# Altium schematic sheet Current_Sensing.SchDoc
size A4; SheetNumber: 2; SheetTotal: 6
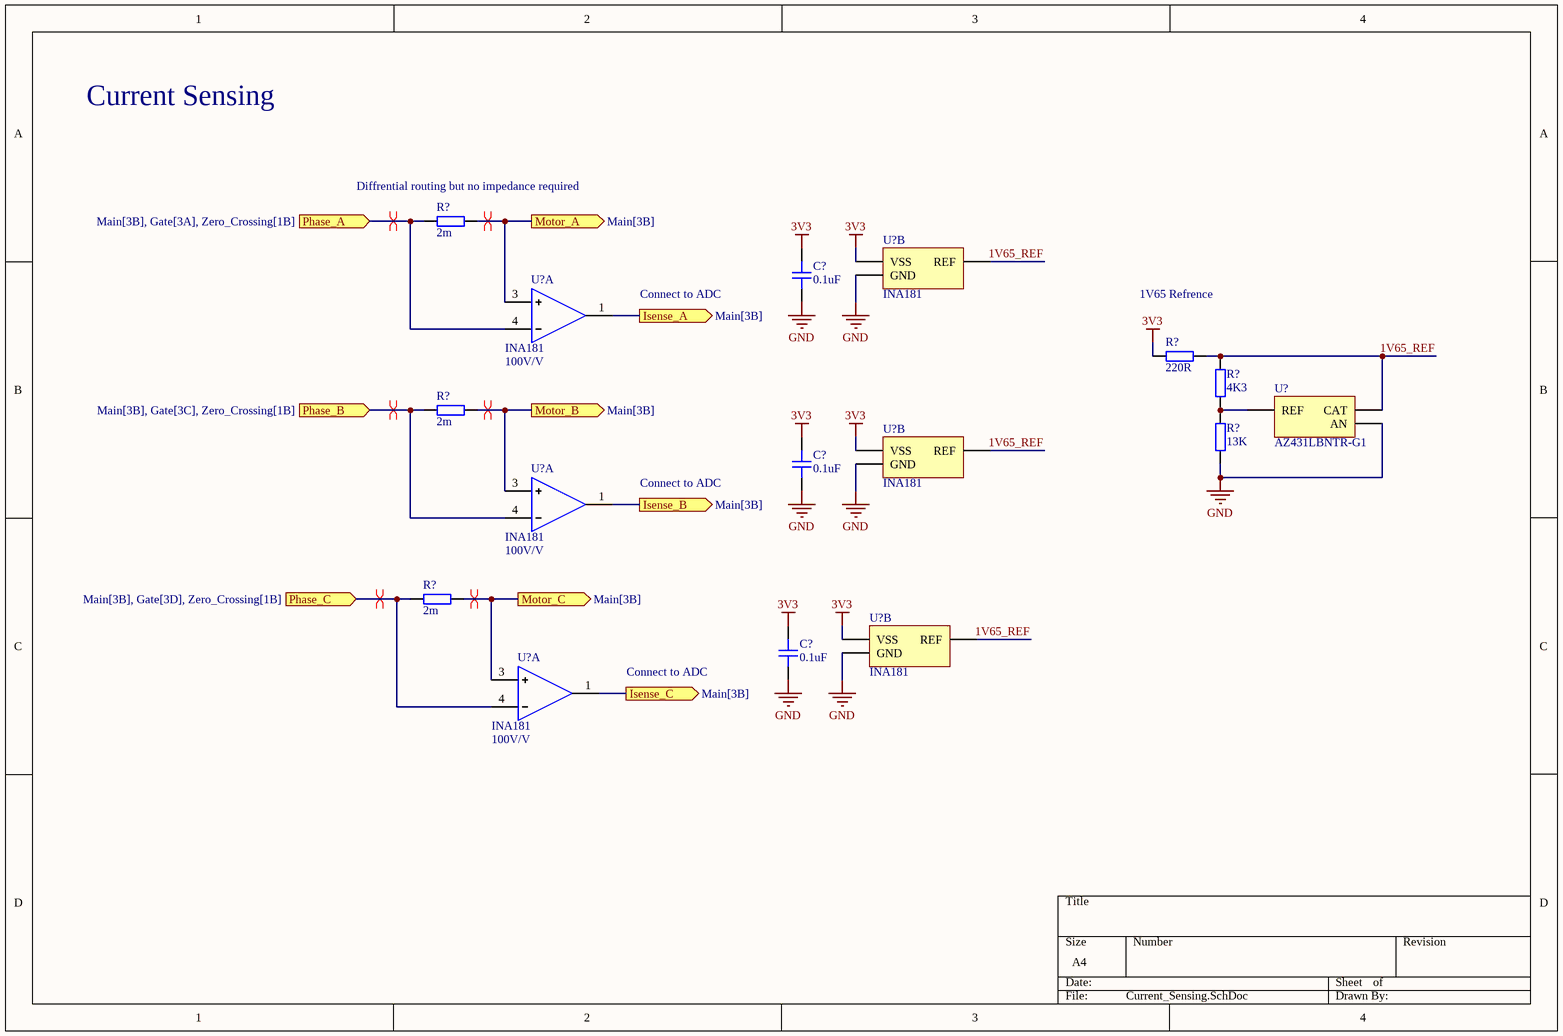
[diagram p0: Current_Sensing.SchDoc]

## Parts
(Parts that share a designator on the sheet are numbered #1, #2 ... from top to bottom, then left to right.)
C?#1  0.1uF  [CAP_0402]
C?#2  0.1uF  [CAP_0402]
C?#3  0.1uF  [CAP_0402]
R?#1  2m  [RES_0402]
R?#2  220R  [RES_0402]
R?#3  4K3  [RES_0402]
R?#4  2m  [RES_0402]
R?#5  13K  [RES_0402]
R?#6  2m  [RES_0402]
U?#1  INA181  [INA181]  (part B of 2)
U?#2  INA181  [INA181]  (part A of 2)
U?#3  AZ431LBNTR-G1  [SOT-23-3]
U?#4  INA181  [INA181]  (part B of 2)
U?#5  INA181  [INA181]  (part A of 2)
U?#6  INA181  [INA181]  (part B of 2)
U?#7  INA181  [INA181]  (part A of 2)

## Ports
Isense_A (out, see Main[3B]), Isense_B (out, see Main[3B]), Isense_C (out, see Main[3B]), Motor_A (out, see Main[3B]), Motor_B (out, see Main[3B]), Motor_C (out, see Main[3B]), Phase_A (in, see Main[3B], Gate[3A], Zero_Crossing[1B]), Phase_B (in, see Main[3B], Gate[3C], Zero_Crossing[1B]), Phase_C (in, see Main[3B], Gate[3D], Zero_Crossing[1B])

## Nets
3V3: C?#1.2 C?#2.2 C?#3.2 R?#2.2 U?#1.6(VSS) U?#4.6(VSS) U?#6.6(VSS)
GND: C?#1.1 C?#2.1 C?#3.1 R?#5.1 U?#1.2(GND) U?#3.3(AN) U?#4.2(GND) U?#6.2(GND)
1V65_REF: R?#2.1 R?#3.2 U?#1.5(REF) U?#3.2(CAT) U?#4.5(REF) U?#6.5(REF)
Isense_A: U?#2.1 ; port Isense_A
Isense_B: U?#5.1 ; port Isense_B
Isense_C: U?#7.1 ; port Isense_C
Motor_A: R?#1.2 U?#2.3 ; port Motor_A
Motor_B: R?#4.2 U?#5.3 ; port Motor_B
Motor_C: R?#6.2 U?#7.3 ; port Motor_C
Phase_A: R?#1.1 U?#2.4 ; port Phase_A
Phase_B: R?#4.1 U?#5.4 ; port Phase_B
Phase_C: R?#6.1 U?#7.4 ; port Phase_C
NetR?#3_1: R?#3.1 R?#5.2 U?#3.1(REF)

## Layout directives
differential pair: Motor_A, Motor_B, Motor_C, Phase_A, Phase_B, Phase_C

## Notes on the sheet
- Current Sensing
- (near R?#1) Diffrential routing but no impedance required
- Connect to ADC
- 1V65 Refrence
- (near U?#2) 100V/V
- (near U?#5) 100V/V
- (near U?#7) 100V/V

## Library data of the parts
C?#1-C?#3 = CAP_0402: Capacitor SMD 0402; Manufacturer: *; Manufacturer Part Number: *; Distributor Link: *; LCSC: *; Rating: *; Dielectric: *
R?#1-R?#6 = RES_0402: Resistor SMD 0402; Manufacturer: *; Manufacturer Part Number: *; Distributor Link: *; LCSC: *
U?#3 = AZ431LBNTR-G1: IC VREF SHUNT ADJ 1% SOT23-3